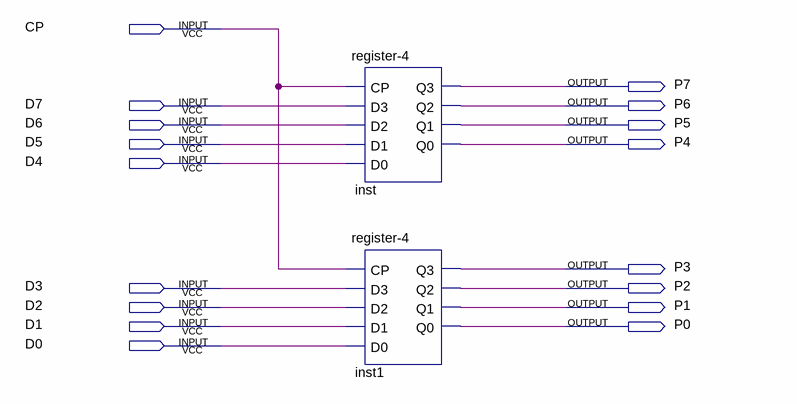
[diagram p0: schematic sheet]
// Quartus schematic register-8.bdf as structural Verilog: 2 symbols, 17 pins
module \register-8  (
  input  CP,
  input  D7,
  input  D6,
  input  D5,
  input  D4,
  input  D3,
  input  D2,
  input  D1,
  input  D0,
  output P7,
  output P6,
  output P5,
  output P4,
  output P3,
  output P2,
  output P1,
  output P0
);

  \register-4  inst (.CP(CP), .D3(D7), .D2(D6), .D1(D5), .D0(D4), .Q3(P7), .Q2(P6), .Q1(P5), .Q0(P4));
  \register-4  inst1 (.CP(CP), .D3(D3), .D2(D2), .D1(D1), .D0(D0), .Q3(P3), .Q2(P2), .Q1(P1), .Q0(P0));
endmodule
